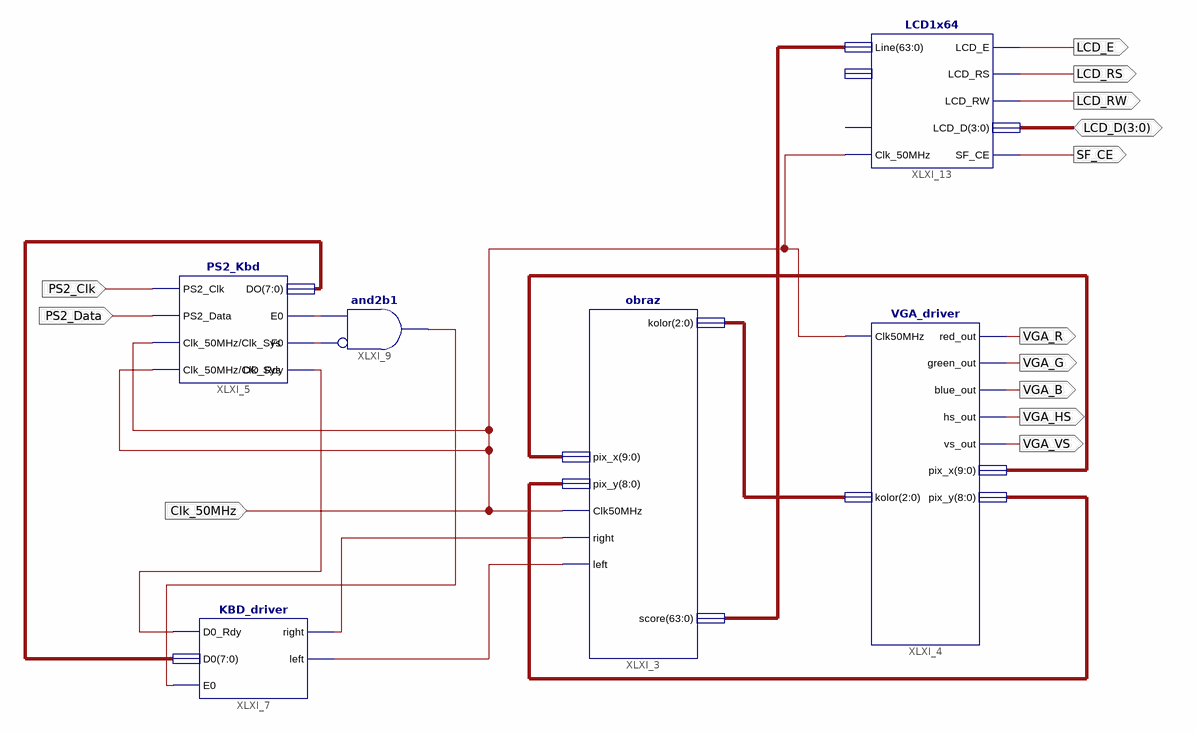
[diagram p0: schematic sheet 1]
// Xilinx ISE schematic ukladzik.sch (spartan3e) as structural Verilog: 6 symbols, 13 ports
module ukladzik (
  input  PS2_Clk,
  input  PS2_Data,
  input  Clk_50MHz,
  inout  [3:0] LCD_D,
  output VGA_G,
  output VGA_B,
  output VGA_HS,
  output VGA_VS,
  output VGA_R,
  output LCD_RW,
  output LCD_RS,
  output LCD_E,
  output SF_CE
);

  wire XLXN_48, XLXN_49, XLXN_50, XLXN_52, XLXN_53, XLXN_54;
  wire [2:0] XLXN_20;
  wire [7:0] XLXN_47;
  wire [8:0] XLXN_27;
  wire [9:0] XLXN_26;
  wire [63:0] XLXN_82;

  obraz XLXI_3 (
    .right(XLXN_50), .left(XLXN_49), .Clk50MHz(Clk_50MHz), .pix_x(XLXN_26), .pix_y(XLXN_27), .kolor(XLXN_20),
    .score(XLXN_82));
  VGA_driver XLXI_4 (
    .Clk50MHz(Clk_50MHz), .kolor(XLXN_20), .red_out(VGA_R), .green_out(VGA_G), .blue_out(VGA_B),
    .hs_out(VGA_HS), .vs_out(VGA_VS), .pix_x(XLXN_26), .pix_y(XLXN_27));
  PS2_Kbd XLXI_5 (
    .PS2_Clk(PS2_Clk), .PS2_Data(PS2_Data), .Clk_50MHz(Clk_50MHz), .E0(XLXN_52), .F0(XLXN_53),
    .DO_Rdy(XLXN_48), .DO(XLXN_47), .Clk_Sys(Clk_50MHz));
  KBD_driver XLXI_7 (.D0_Rdy(XLXN_48), .E0(XLXN_54), .D0(XLXN_47), .right(XLXN_50), .left(XLXN_49));
  and XLXI_9 (XLXN_54, ~XLXN_53, XLXN_52);  // and2b1
  LCD1x64 XLXI_13 (
    .Clk_50MHz(Clk_50MHz), .Line(XLXN_82), .LCD_D(LCD_D), .LCD_E(LCD_E), .LCD_RW(LCD_RW), .LCD_RS(LCD_RS),
    .SF_CE(SF_CE));  // open: Reset, Blank
endmodule
